# Altium schematic sheet MSP_Adapter.SchDoc
size A4; SheetNumber: 1; SheetTotal: 1
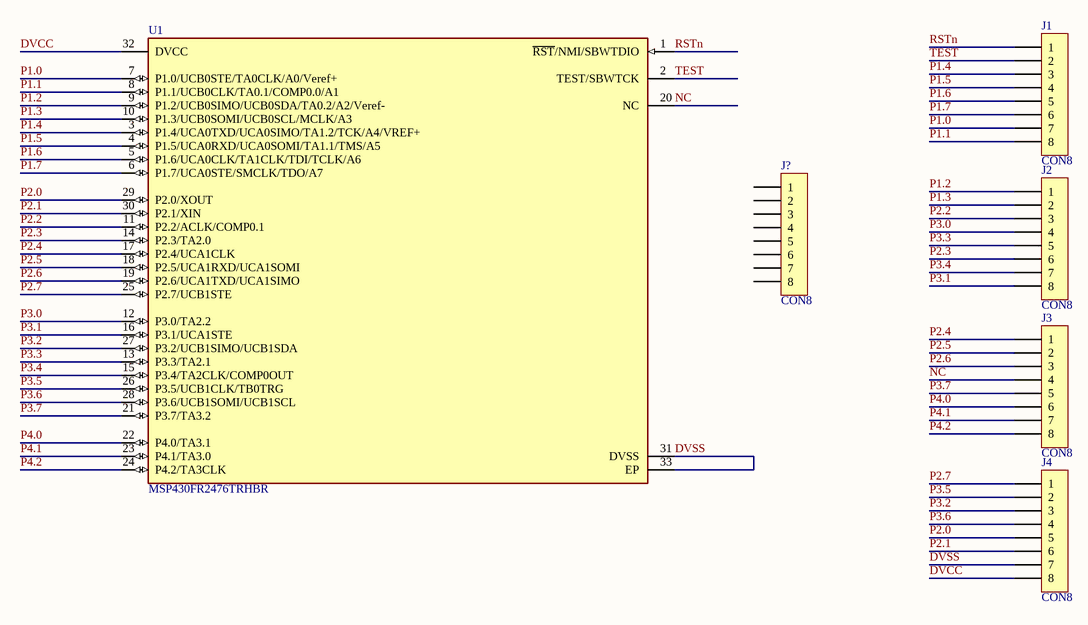
[diagram p0: MSP_Adapter.SchDoc]

## Parts
J1  CON8  [SIP8]
J2  CON8  [SIP8]
J3  CON8  [SIP8]
J4  CON8  [SIP8]
J?  CON8  [SIP8]
U1  MSP430FR2476TRHBR  [FP-RHB0032E-IPC_A]

## Nets
DVCC: J4.8 U1.32(DVCC)
DVSS: J4.7 U1.31(DVSS) U1.33(EP)
NC: J3.4 U1.20(NC)
P1.0: J1.7 U1.7(P1.0/UCB0STE/TA0CLK/A0/Veref+)
P1.1: J1.8 U1.8(P1.1/UCB0CLK/TA0.1/COMP0.0/A1)
P1.2: J2.1 U1.9(P1.2/UCB0SIMO/UCB0SDA/TA0.2/A2/Veref-)
P1.3: J2.2 U1.10(P1.3/UCB0SOMI/UCB0SCL/MCLK/A3)
P1.4: J1.3 U1.3(P1.4/UCA0TXD/UCA0SIMO/TA1.2/TCK/A4/VREF+)
P1.5: J1.4 U1.4(P1.5/UCA0RXD/UCA0SOMI/TA1.1/TMS/A5)
P1.6: J1.5 U1.5(P1.6/UCA0CLK/TA1CLK/TDI/TCLK/A6)
P1.7: J1.6 U1.6(P1.7/UCA0STE/SMCLK/TDO/A7)
P2.0: J4.5 U1.29(P2.0/XOUT)
P2.1: J4.6 U1.30(P2.1/XIN)
P2.2: J2.3 U1.11(P2.2/ACLK/COMP0.1)
P2.3: J2.6 U1.14(P2.3/TA2.0)
P2.4: J3.1 U1.17(P2.4/UCA1CLK)
P2.5: J3.2 U1.18(P2.5/UCA1RXD/UCA1SOMI)
P2.6: J3.3 U1.19(P2.6/UCA1TXD/UCA1SIMO)
P2.7: J4.1 U1.25(P2.7/UCB1STE)
P3.0: J2.4 U1.12(P3.0/TA2.2)
P3.1: J2.8 U1.16(P3.1/UCA1STE)
P3.2: J4.3 U1.27(P3.2/UCB1SIMO/UCB1SDA)
P3.3: J2.5 U1.13(P3.3/TA2.1)
P3.4: J2.7 U1.15(P3.4/TA2CLK/COMP0OUT)
P3.5: J4.2 U1.26(P3.5/UCB1CLK/TB0TRG)
P3.6: J4.4 U1.28(P3.6/UCB1SOMI/UCB1SCL)
P3.7: J3.5 U1.21(P3.7/TA3.2)
P4.0: J3.6 U1.22(P4.0/TA3.1)
P4.1: J3.7 U1.23(P4.1/TA3.0)
P4.2: J3.8 U1.24(P4.2/TA3CLK)
RSTn: J1.1 U1.1(~{RST}/NMI/SBWTDIO)
TEST: J1.2 U1.2(TEST/SBWTCK)

Not connected (* = marked no-connect by the designer): J? 1 2 3 4 5 6 7 8

## Library data of the parts
U1 = CMP-04869-000099-1: IC MCU 16BIT 64.5KB FRAM 32VQFN